# Altium schematic sheet [1]-COVER_PAGE.SchDoc
size A4
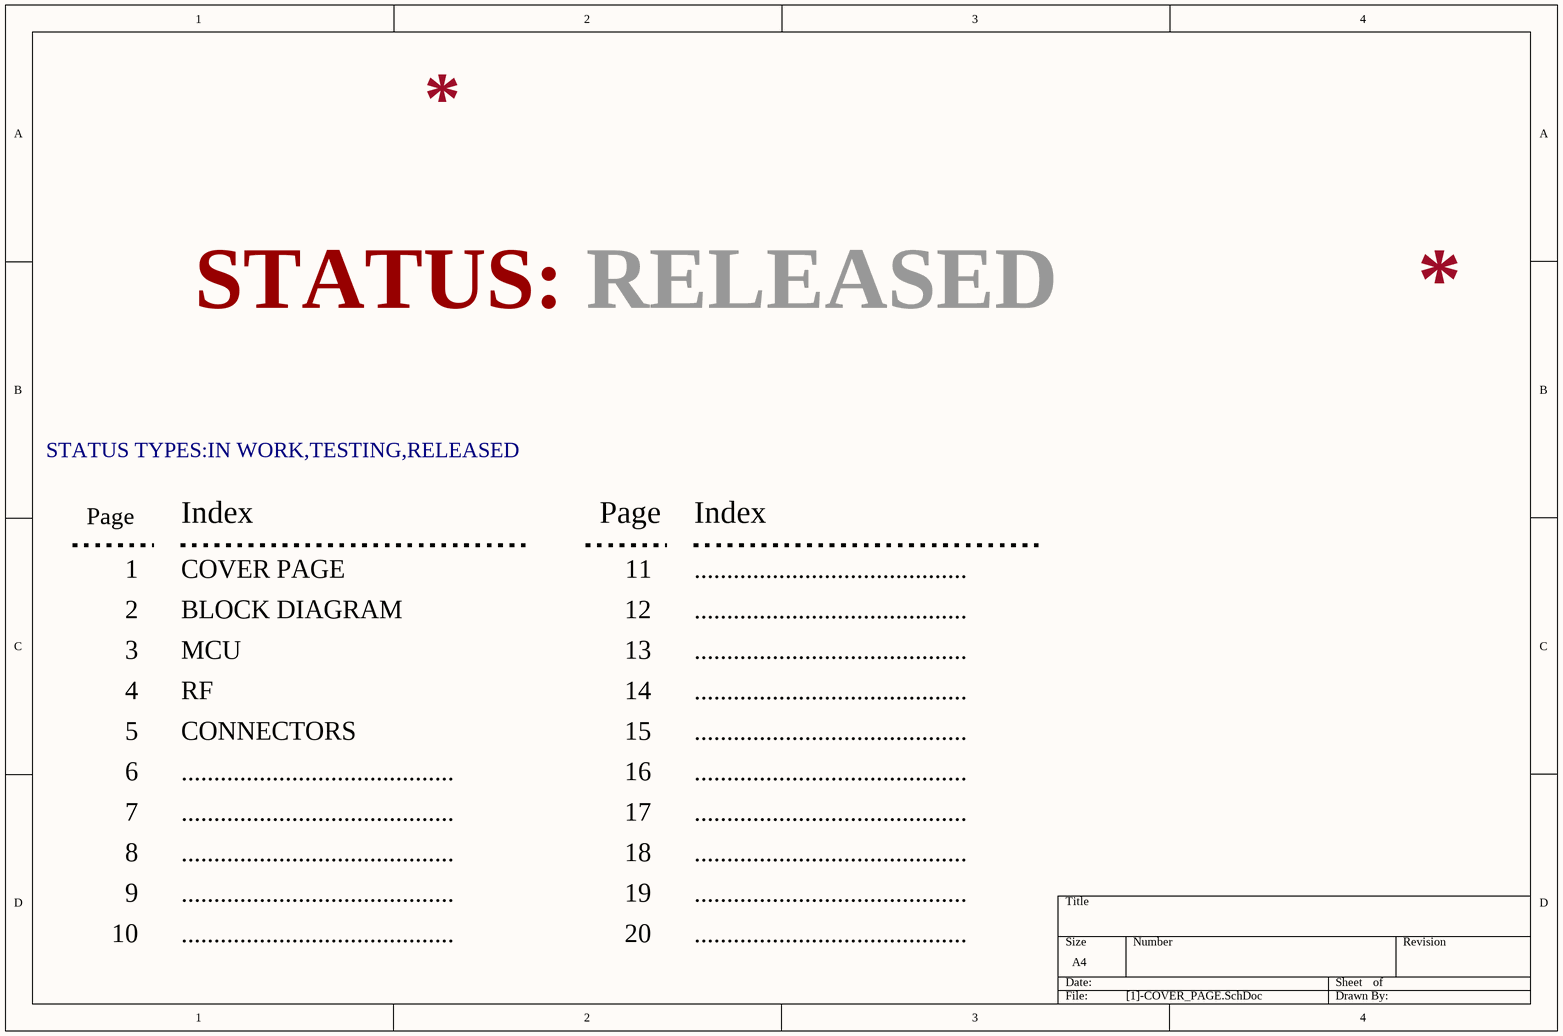
[diagram p0: [1]-COVER_PAGE.SchDoc]

## Notes on the sheet
- STATUS:
- RELEASED
- STATUS TYPES:IN WORK,TESTING,RELEASED
- Page
- 1
- Index
- COVER PAGE
- 11
- ..........................................
- 2
- BLOCK DIAGRAM
- 12
- 3
- 4
- MCU
- RF
- 13
- 14
- 5
- 6
- CONNECTORS
- 15
- 16
- 7
- 17
- 8
- 9
- 18
- 19
- 10
- 20